# Altium schematic sheet AK4430_2.SchDoc: nRF2789_Dual_Wireless_Mic_RX
size A4; DrawnBy: ANOL; Revision: 1.0
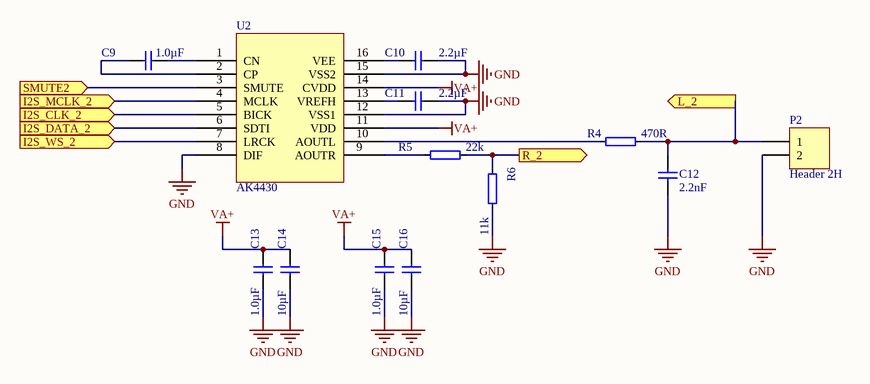
[diagram p0: AK4430_2.SchDoc]

## Parts
C9  1.0µF  [0603s]
C10  2.2µF  [0603s]
C11  2.2µF  [0603s]
C12  2.2nF  [0402s]
C13  1.0µF  [0603s]
C14  10µF  [0805]
C15  1.0µF  [0603s]
C16  10µF  [0805]
P2  Header 2H  [RCA]
R4  470R  [0402s]
R5  22k  [0402s]
R6  11k  [0402s]
U2  AK4430  [TSOP65P640X110-16N]

## Ports
I2S_CLK_2 (in), I2S_DATA_2 (in), I2S_MCLK_2 (in), I2S_WS_2 (in), L_2 (out), R_2 (out), SMUTE2 (in)

## Nets
GND: C10.2 C11.2 C12.1 C13.1 C14.1 C15.1 C16.1 P2.2 R6.1 U2.8(DIF) U2.12(VSS1) U2.15(VSS2)
VA+: C13.2 C14.2 C15.2 C16.2 U2.11(VDD) U2.14(CVDD)
I2S_CLK_2: U2.5(BICK) ; port I2S_CLK_2
I2S_DATA_2: U2.6(SDTI) ; port I2S_DATA_2
I2S_MCLK_2: U2.4(MCLK) ; port I2S_MCLK_2
I2S_WS_2: U2.7(LRCK) ; port I2S_WS_2
L_2: C12.2 P2.1 R4.2 ; port L_2
R_2: R5.2 R6.2 ; port R_2
SMUTE2: U2.3(SMUTE) ; port SMUTE2
NetC9_1: C9.1 U2.2(CP)
NetC9_2: C9.2 U2.1(CN)
NetC10_1: C10.1 U2.16(VEE)
NetC11_1: C11.1 U2.13(VREFH)
NetR4_1: R4.1 U2.10(AOUTL)
NetR5_1: R5.1 U2.9(AOUTR)

## Library data of the parts
C9 C13 C15 = C0603-1µ0: Chip Cap 0603; Note: Chip Cap 10%; Artikkelnr Noca: 20039205; Part Number: C0603-1µ0; Manufacturer: *; Manufacturer Part Number: *; Datasheet: *; LatestRevisionDate: 2009-11-23; Pin Count: 2; Publisher: Nordic Semiconductor; Published: 2009-05-08; Value: 1.0µF; Supplier: *; Supplier part number: *; 2nd source Supplier: *; 2nd source part number: *
C10 C11 = C0603-2µ2: Chip Cap 0603; Note: Chip Cap 1%; Artikkelnr Noca: N.A.; Part Number: C0603-2µ2; Manufacturer: *; Manufacturer Part Number: *; Datasheet: *; LatestRevisionDate: 2009-05-08; Pin Count: 2; Publisher: Nordic Semiconductor; Published: 2009-05-08; Value: 2.2µF; Supplier: *; Supplier part number: *; 2nd source Supplier: *; 2nd source part number: *
C12 = C0402-2n2: Chip Cap 0402; Note: Chip Cap 10%; Artikkelnr Noca: 20039221; Part Number: C0402-2n2; Manufacturer: *; Manufacturer Part Number: *; Datasheet: *; LatestRevisionDate: 2009-11-23; Pin Count: 2; Publisher: Nordic Semiconductor; Published: 2009-05-08; Value: 2.2nF; Supplier: *; Supplier part number: *; 2nd source Supplier: *; 2nd source part number: *
C14 C16 = C0805-10µ: Chip Cap 0805; Note: Chip Cap 10%; Artikkelnr Noca: 20039243; Part Number: C0805-10µ; Manufacturer: *; Manufacturer Part Number: *; Datasheet: *; LatestRevisionDate: 2010-06-03; Pin Count: 2; Publisher: Nordic Semiconductor; Published: 2010-06-03; Value: 10µF; Supplier: *; Supplier part number: *; 2nd source Supplier: *; 2nd source part number: *
P2 = Header 2H: Header, 2-Pin, Right Angle; LatestRevisionDate: 17-Jul-2002; LatestRevisionNote: Re-released for DXP Platform.; Publisher: Altium Limited
R4 = R0402-470: Chip Res 0402; Note: Chip Res 1%; Artikkelnr Noca: 27049065; Part Number: R0402-470; Manufacturer: *; Manufacturer Part Number: *; Datasheet: *; Footprint: 0402; LatestRevisionDate: 2009-11-23; Pin Count: 2; Publisher: Nordic Semiconductor; Published: 2009-05-08; Value: 470R; Supplier: *; Supplier part number: *; 2nd source Supplier: *; 2nd source part number: *
R5 = R0402-22k: Chip Res 0402; Note: Chip Res 1%; Artikkelnr Noca: 27049105; Part Number: R0402-22k; Manufacturer: *; Manufacturer Part Number: *; Datasheet: *; Footprint: 0402; LatestRevisionDate: 2009-11-23; Pin Count: 2; Publisher: Nordic Semiconductor; Published: 2009-05-08; Value: 22k; Supplier: *; Supplier part number: *; 2nd source Supplier: *; 2nd source part number: *
R6 = R0402-10k: Chip Res 0402; Note: Chip Res 1%; Part Number: R0402-10k; Manufacturer: *; Manufacturer Part Number: *; Datasheet: *; Footprint: 0402; LatestRevisionDate: 2009-11-23; Pin Count: 2; Publisher: Nordic Semiconductor; Published: 2009-05-08; Value: 11k; Supplier: *; Supplier part number: *; 2nd source Supplier: *; 2nd source part number: *